# Altium schematic sheet tempsens_to_ADC.SchDoc
size A4
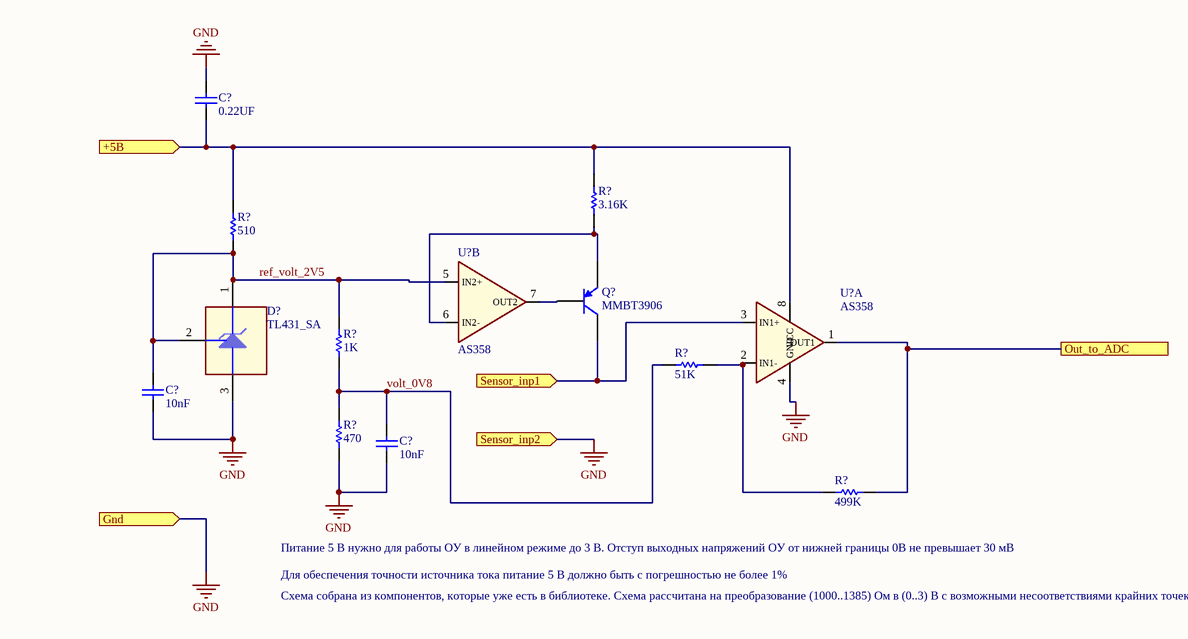
[diagram p0: tempsens_to_ADC.SchDoc]

## Parts
(Parts that share a designator on the sheet are numbered #1, #2 ... from top to bottom, then left to right.)
C?#1  value 0.22UF  [CAP 0402/1005]  (hidden comment: Cap)
C?#2  value 10nF  [CAP 0402/1005]  (hidden comment: Cap)
C?#3  value 10nF  [CAP 0402/1005]  (hidden comment: Cap)
D?  TL431_SA  [SOT-23-3]
Q?  value MMBT3906  [SOT-23-3]  (hidden comment: PNP)
R?#1  value 3.16K  [RES 0402/1005]  (hidden comment: Res1)
R?#2  value 510  [RES 0402/1005]  (hidden comment: Res1)
R?#3  value 51K  [RES 0402/1005]  (hidden comment: Res1)
R?#4  value 1K  [RES 0402/1005]  (hidden comment: Res1)
R?#5  value 470  [RES 0603/1608]  (hidden comment: Res1)
R?#6  value 499K  [RES 0402/1005]  (hidden comment: Res1)
U?#1  AS358  [SOIC-8]  (part B of 2)
U?#2  AS358  [SOIC-8]  (part A of 2)

## Ports
+5В (in), Gnd (in), Out_to_ADC, Sensor_inp1 (in), Sensor_inp2 (in)

## Nets
GND: C?#1.2 C?#2.1 C?#3.1 D?.3(A) R?#5.1 U?#2.4(GND) ; port Gnd, port Sensor_inp2
+5В: C?#1.1 R?#1.2 R?#2.2 U?#2.8(VCC) ; port +5В
Out_to_ADC: R?#6.2 U?#2.1(OUT1) ; port Out_to_ADC
ref_volt_2V5: C?#2.2 D?.1(K) D?.2(R) R?#2.1 R?#4.2 U?#1.5(IN2+)
Sensor_inp1: Q?.3(C) U?#2.3(IN1+) ; port Sensor_inp1
volt_0V8: C?#3.2 R?#3.1 R?#4.1 R?#5.2
NetQ?_1: Q?.1(B) U?#1.7(OUT2)
NetQ?_2: Q?.2(E) R?#1.1 U?#1.6(IN2-)
NetR?#3_2: R?#3.2 R?#6.1 U?#2.2(IN1-)

## Notes on the sheet
- (near R?#6) Питание 5 В нужно для работы ОУ в линейном режиме до 3 В. Отступ выходных напряжений ОУ от нижней границы 0В не превышает 30 мВ
- Схема собрана из компонентов, которые уже есть в библиотеке. Схема рассчитана на преобразование (1000..1385) Ом в (0..3) В с возможными несоответствиями крайних точек (0В, 3В) в три-четыре процента. Точность можно улучшить.
- Для обеспечения точности источника тока питание 5 В должно быть с погрешностью не более 1%

## Library data of the parts
C?#1 = C1005X7R1V224K050BE: CAP CER 0.22UF 35V X7R 0402; Manufacturer: TDK Corporation; Part Number: C1005X7R1V224K050BE; Supplier 1: Digi-Key; Supplier Part Number 1: 445-173778-1-ND; Manufacturer Part Number: C1005X7R1V224K050BE; RoHS: RoHS Compliant; Category: Capacitors; Stock 1: 50; Pricing 1: 1=0.28, 10=0.19, 100=0.0961, 500=0.06578, 1000=0.05819, 2500=0.05566, 5000=0.0506 (USD); Packaging: Cut Tape (CT); Part Status: Active; Operating Temperature: -55°C ~ 125°C; Package / Case: 0402 (1005 Metric)
C?#2 C?#3 = GRM155R71H103KA88J: CAP CER 10000PF 50V X7R 0402; Manufacturer: Murata Electronics North America; Part Number: GRM155R71H103KA88J; Supplier 1: Digi-Key; Supplier Part Number 1: 490-6351-1-ND; Manufacturer Part Number: GRM155R71H103KA88J; RoHS: RoHS Compliant; Category: Capacitors; Stock 1: 879911; Pricing 1: 1=0.1, 10=0.011, 25=0.0076, 50=0.0058, 100=0.0047, 250=0.00396, 500=0.00338, 1000=0.00266, 5000=0.00222 (USD); Packaging: Cut Tape (CT); Part Status: Active; Operating Temperature: -55°C ~ 125°C; Package / Case: 0402 (1005 Metric)
D? = TL431BSA-7: IC VREF SHUNT 36V 0.5% SOT23-3; Manufacturer: Diodes; Part Number: TL431BSA-7; Value: TL431_SA; Supplier 1: Digi-Key; Supplier Part Number 1: TL431BSA-7DICT-ND; Manufacturer Part Number: TL431BSA-7; Stock 1: 155505; Pricing 1: 1=0.45, 10=0.339, 25=0.3056, 100=0.1667, 250=0.1611, 500=0.1444, 1000=0.1111 (USD); Packaging: Cut Tape (CT); Part Status: Active; Operating Temperature: -40°C ~ 125°C (TA); DateOfRevision: 30.06.2020
Q? = MMBT3906,215: TRANS PNP 40V 200MA TO236AB (SOT23); Manufacturer: Nexperia USA Inc.; Part Number: MMBT3906,215; Supplier 1: Digi-Key; Supplier Part Number 1: 1727-4045-1-ND; Manufacturer Part Number: MMBT3906,215; Stock 1: 38979; Pricing 1: 1=0.13, 10=0.122, 100=0.0667, 500=0.04104, 1000=0.02798 (USD); Packaging: Cut Tape (CT); Part Status: Active; Operating Temperature: 150°C (TJ); DateOfRevision: 06.10.2021
R?#1 = CRCW04023K16FKED: RES SMD 3.16K OHM 1% 1/16W 0402; Manufacturer: Vishay Dale; Part Number: CRCW04023K16FKED; Supplier 1: Digi-Key; Supplier Part Number 1: 541-3.16KLCT-ND; Manufacturer Part Number: CRCW04023K16FKED; RoHS: RoHS Compliant; Category: Resistors; Stock 1: 30040; Pricing 1: 1=0.1, 10=0.037, 100=0.0149, 1000=0.0067, 2500=0.00582, 5000=0.00481 (USD); Packaging: Cut Tape (CT); Part Status: Active; Operating Temperature: -55°C ~ 155°C; Package / Case: 0402 (1005 Metric)
R?#2 = RC0402JR-07510RL: RES 510 OHM 5% 1/16W 0402; Manufacturer: Yageo; Voltage Rating (DC): 50V; Max Power Dissipation: 63mW; Resistance: 510R; Power Rating: 62.5mW; Temperature Coefficient: 100ppm/°C; Part Number: RC0402JR-07510RL; Supplier 1: Digi-Key; Supplier Part Number 1: 311-510JRCT-ND; Manufacturer Part Number: RC0402JR-07510RL; Stock 1: 987964; Pricing 1: 1=0.1, 10=0.013, 100=0.0054, 1000=0.0024, 2500=0.0021, 5000=0.0018 (USD); Packaging: Cut Tape (CT); Part Status: Active; Operating Temperature: -55°C ~ 155°C; DateOfRevision: 31.12.2021; Case/Package: 0402; Min Operating Temperature: -55°C; Max Operating Temperature: 155°C; Termination: SMD/SMT; Resistor Type: Thick Film; Series: RC; Length: 1mm; Width: 0.5mm; Height: 0.35mm; Radiation Hardening: No; Lead Free: Lead Free; RoHS Compliant: Yes; REACH SVHC: No SVHC; ComponentLink1URL: http://www.yageo.com/documents/recent/PYu-RC0402_51_RoHS_L_6_r.pdf?src-supplier=Mouser; ComponentLink1Description: http://www.yageo.com/documents/recent/PYu-RC0402_51_RoHS_L_6_r.pdf?src-supplier=Mouser; ComponentLink2URL: http://www.yageo.com/documents/recent/PYu-RC0402_51_RoHS_L_6.pdf?src-supplier=Avnet; ComponentLink2Description: http://www.yageo.com/documents/recent/PYu-RC0402_51_RoHS_L_6.pdf?src-supplier=Avnet; ComponentLink3URL: http://www.yageo.com/documents/recent/PYu-RC0402_51_RoHS_L_6_r.pdf?src-supplier=Future+Electronics; ComponentLink3Description: http://www.yageo.com/documents/recent/PYu-RC0402_51_RoHS_L_6_r.pdf?src-supplier=Future+Electronics; ComponentLink4URL: http://www.yageo.com/documents/recent/PYu-RC0402_51_RoHS_L_6.pdf?src-supplier=Avnet+Europe; ComponentLink4Description: http://www.yageo.com/documents/recent/PYu-RC0402_51_RoHS_L_6.pdf?src-supplier=Avnet+Europe; Case Code (Metric): 1005; Case Code (Imperial): 0402; Tolerance: 5%; Voltage Rating: 50V; Number of Terminations: 2; Construction: Rectangular; Depth: 0.5mm; Military Standard: Not; Features: Moisture Resistant; Resistance Tolerance: 5%; Contact Plating: Tin,Matte; Size Code: 0402
R?#3 = RMCF0402FT51K0: RES 51K OHM 1% 1/16W 0402; Manufacturer: Stackpole Electronics; Part Number: RMCF0402FT51K0; Supplier 1: Digi-Key; Supplier Part Number 1: RMCF0402FT51K0CT-ND; Manufacturer Part Number: RMCF0402FT51K0; Stock 1: 414317; Pricing 1: 1=0.1, 10=0.015, 100=0.0061, 1000=0.00274, 2500=0.00238, 5000=0.00197 (USD); Packaging: Cut Tape (CT); Part Status: Active; Operating Temperature: -55°C ~ 155°C; DateOfRevision: 15.12.2021
R?#4 = RC0402FR-071KL: RES SMD 1K OHM 1% 1/16W 0402; Manufacturer: Yageo; Part Number: RC0402FR-071KL; Supplier 1: Digi-Key; Supplier Part Number 1: 311-1.00KLRCT-ND; Manufacturer Part Number: RC0402FR-071KL; RoHS: RoHS Compliant; Category: Resistors; Stock 1: 10130164; Pricing 1: 1=0.1, 10=0.014, 100=0.0056, 1000=0.00253, 2500=0.0022, 5000=0.00181 (USD); Packaging: Cut Tape (CT); Part Status: Active; Operating Temperature: -55°C ~ 155°C; Package / Case: 0402 (1005 Metric)
R?#5 = RC0603FR-07470RL: RES 470 OHM 1% 1/10W 0603; Manufacturer: Yageo; Part Number: RC0603FR-07470RL; Supplier 1: Digi-Key; Supplier Part Number 1: 311-470HRCT-ND; Manufacturer Part Number: RC0603FR-07470RL; Stock 1: 2248171; Pricing 1: 1=0.1, 10=0.024, 100=0.0097, 1000=0.00436, 2500=0.00378 (USD); Packaging: Cut Tape (CT); Part Status: Active; Operating Temperature: -55°C ~ 155°C; DateOfRevision: 14.07.2022
R?#6 = RC0402FR-07499KL: RES SMD 499K OHM 1% 1/16W 0402; Manufacturer: Yageo; Part Number: RC0402FR-07499KL; Supplier 1: Digi-Key; Supplier Part Number 1: 311-499KLRCT-ND; Manufacturer Part Number: RC0402FR-07499KL; RoHS: RoHS Compliant; Category: Resistors; Stock 1: 708253; Pricing 1: 1=0.1, 10=0.014, 100=0.0056, 1000=0.0025, 2500=0.0022, 5000=0.0018 (USD); Packaging: Tape and Reel
U?#1 U?#2 = AS358MTR-G1: IC OPAMP GP 2 CIRCUIT 8SOIC; Manufacturer: Diodes; Max Power Dissipation: 550mW; Output Current per Channel: 40mA; Min Dual Supply Voltage: 1.5V; Min Supply Voltage: 3V; Max Dual Supply Voltage: 18V; Max Supply Voltage: 36V; Number of Circuits: 2; Part Number: AS358MTR-G1; Value: AS358; Supplier 1: Digi-Key; Supplier Part Number 1: 1034-AS358MTR-G1DICT-ND; Manufacturer Part Number: AS358MTR-G1; Stock 1: 296; Pricing 1: 1=0.28, 10=0.232, 25=0.1944, 100=0.1231, 250=0.095 (USD); Packaging: Cut Tape (CT); Part Status: Active; Operating Temperature: -40°C ~ 85°C (TA); DateOfRevision: 27.01.2022; Mount: Surface Mount; Case/Package: SOIC; Number of Pins: 8; Min Operating Temperature: -40°C; Max Operating Temperature: 85°C; Package Quantity: 4000; Length: 5.1mm; Width: 4mm; Height: 1.45mm; Lead Free: Lead Free; RoHS Compliant: Yes; ComponentLink1URL: http://www.diodes.com/datasheets/AS358_A.pdf?src-supplier=Avnet; ComponentLink1Description: http://www.diodes.com/datasheets/AS358_A.pdf?src-supplier=Avnet